# Altium project SWD adapter.PrjPcb
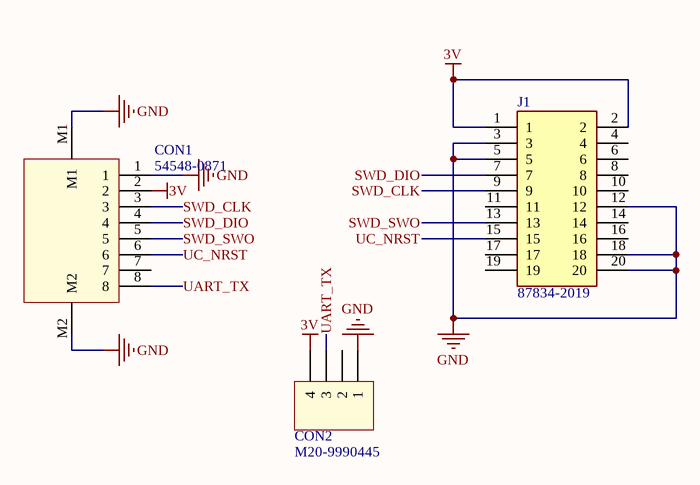
[diagram p0: SWD adapter.SchDoc]
1 sheet, 3 parts. Net scope: global (net labels, ports and power ports of the same name join across sheets).
Board file: SWD adapter.PcbDoc

## Sheet SWD adapter.SchDoc
size A4; SheetNumber: 1; SheetTotal: 1

### Parts
CON1  54548-0871  [54548-0871]
CON2  M20-9990445  [M20-9990445]
J1  87834-2019  [87834-2019]

### Nets
3V: CON1.2 CON2.4 J1.1 J1.2
GND: CON1.1 CON1.M1 CON1.M2 CON2.1 J1.3 J1.5 J1.12 J1.18 J1.20
SWD_CLK: CON1.3 J1.9
SWD_DIO: CON1.4 J1.7
SWD_SWO: CON1.5 J1.13
UART_TX: CON1.8 CON2.3
UC_NRST: CON1.6 J1.15

Not connected (* = marked no-connect by the designer): CON1 7; CON2 2; J1 4 6 8 10 11 14 16 17 19

### Library data of the parts
CON1 = 54548-0871: Connecteur FFC/FPC, Right-Angle, Surface Mount, ZIF, Bottom Contact / Style, 30 Circuits; Fabricant: MOLEX; Référence: 54548-0871; Value: 54548-0871
CON2 = M20-9990445: 4 pins RA 2.54mm droit; Fabricant: Harwin; Référence: M20-9990445; Value: M20-9990445
J1 = 87834-2019: Embase PCB, 2.54mm,20 contacts, 2 rangées, traversant; Fabricant: molex; Référence: 87834-2019; Supplier: mouser; RefSupplier: 538-87834-2019; Value: 87834-2019